# Altium schematic sheet Power 3V3.SchDoc
size A
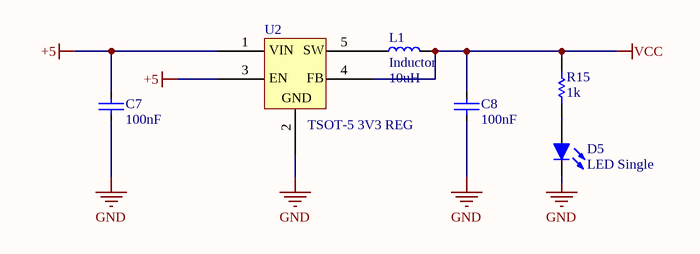
[diagram p0: Power 3V3.SchDoc]

## Parts
C7  100nF  [C0603]
C8  100nF  [C0603]
D5  LED Single  [LED 0603]
L1  Inductor  value 10uH  [C1206]
R15  1k  [R 0603]
U2  TSOT-5 3V3 REG  [SOT-5 3V3 REG]

## Nets
+5: C7.2 U2.1 U2.3
GND: C7.1 C8.1 D5.2(K) U2.2
VCC: C8.2 L1.2 R15.2 U2.4
NetD5_1: D5.1(A) R15.1
NetL1_1: L1.1 U2.5

## Notes on the sheet
- (in symbol TSOT-5 3V3 REG) VIN; SW; EN; FB; GND

## Library data of the parts
C7 C8 = Capacitor: Capacitor Ceramic; Value: 100nF
D5 = LED Single: LED
R15 = Res: Resistor; Value: 1k
U2 = TSOT-5 3V3 REG: ANALOG DEVICES         ADP2108AUJZ-3.3-R7            STEP-DOWN DC/DC CONVERTER, TSOT-5; Output Voltage: 3.3V; Max Output Current: 600mA; Number of Outputs: 1; Max Input Voltage: 5.5V; Min Input Voltage: 2.3V; Efficiency: 95%; Switching Frequency: 3MHz; Synchronous Rectifier: Yes; Operating Supply Current: 30uA; Polarity: Positive; Quiescent Current: 18uA; Accuracy: 2%; Output Type: Fixed; Supplier 1: Farnell; Manufacturer: Analog Devices; Manufacturer Part Number: ADP2108AUJZ-3.3-R7; Stock 1: 5315; Pricing 1: 1=1.61, 25=1.25, 50=1.2, 100=1.15, 250=1.03, 500=0.892, 1000=0.845, 2500=0.798 (EUR); Mount: Surface Mount; Case/Package: TSOT; Number of Pins: 5; Min Operating Temperature: -40°C; Max Operating Temperature: 125°C; Output Current: 600mA; Packaging: Tape and Reel; Nominal Output Voltage: 3.3V; Min Output Voltage: 3.3V; Output Configuration: Positive; Length: 2.9mm; Height: 0.9mm; Width: 1.6mm; Radiation Hardening: No; REACH SVHC: No SVHC; Lead Free: Contains Lead; ComponentLink1URL: http://uk.rs-online.com/webdocs/14ba/0900766b814bac03.pdf?src-supplier=RSComponents; ComponentLink1Description: http://uk.rs-online.com/webdocs/14ba/0900766b814bac03.pdf?src-supplier=RSComponents; ComponentLink2URL: http://www.farnell.com/datasheets/1838518.pdf?src-supplier=Element14; ComponentLink2Description: http://www.farnell.com/datasheets/1838518.pdf?src-supplier=Element14; ComponentLink3URL: http://www.analog.com/static/imported-files/data_sheets/ADP2108.pdf?src-supplier=Avnet; ComponentLink3Description: http://www.analog.com/static/imported-files/data_sheets/ADP2108.pdf?src-supplier=Avnet; ComponentLink4URL: http://www.farnell.com/datasheets/1537430.pdf?src-supplier=Farnell; ComponentLink4Description: http://www.farnell.com/datasheets/1537430.pdf?src-supplier=Farnell; ComponentLink5URL: https://www.analog.com/media/en/technical-documentation/data-sheets/ADP2108.pdf?src-supplier=Digi-Key; ComponentLink5Description: https://www.analog.com/media/en/technical-documentation/data-sheets/ADP2108.pdf?src-supplier=Digi-Key; ComponentLink6URL: http://www.analog.com/media/en/technical-documentation/data-sheets/ADP2108.pdf?src-supplier=Digi-Key; ComponentLink6Description: http://www.analog.com/media/en/technical-documentation/data-sheets/ADP2108.pdf?src-supplier=Digi-Key; Supplier Part Number 1: 2112606